# EAGLE design Puzzle Chainable RGB LED (EAGLE 6.2)
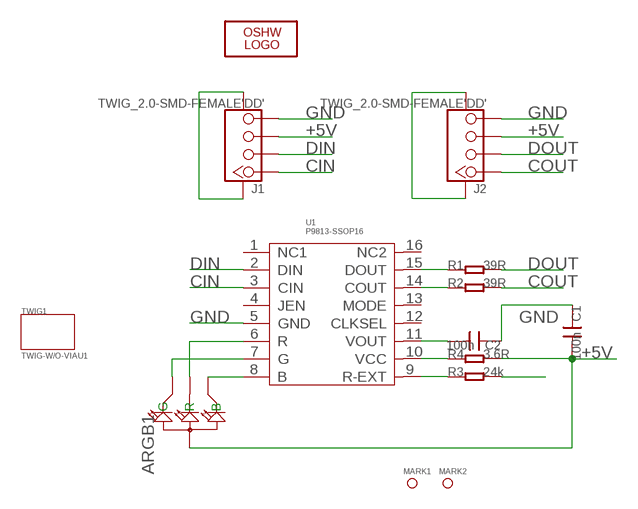
[diagram p0: schematic, sheet 1]

## Parts
ARGB1  LED-ARGB-DIP2.0  [ARGB/2.0]
C1  100n  C-0603  [0603]
C2  100n  C-0603  [0603]
J1  TWIG_2.0-SMD-FEMALE'DD'  [2.0_1X4DD]
J2  TWIG_2.0-SMD-FEMALE'DD'  [2.0_1X4DD]
LOGO1  LOGO-OSHW-FILLX0100-NT  [OSHW_FILLX100_NOTEXT]
MARK1  PAD-MARK  [MARK]
MARK2  PAD-MARK  [MARK]
R1  39R  R-0603  [0603]
R2  39R  R-0603  [0603]
R3  24k  R-0603  [0603]
R4  3.6R  R-0603  [0603]
TWIG1  TWIG-W/O-VIAU1  [U1N]
U1  P9813-SSOP16  [SSOP16]

## Nets
+5V: ARGB1.2(+) C1.2 J1.3 J2.3 R4.2
CIN: J1.1 U1.3(CIN)
COUT: J2.1 R2.2
DIN: J1.2 U1.2(DIN)
DOUT: J2.2 R1.2
GND: C1.1 C2.1 J1.4 J1.SS1 J1.SS2 J2.4 J2.SS1 J2.SS2 R3.2 U1.5(GND)
N$1: ARGB1.4(B) U1.8(B)
N$2: ARGB1.3(G) U1.7(G)
N$3: ARGB1.1(R) U1.6(R)
N$4: R1.1 U1.15(DOUT)
N$5: R2.1 U1.14(COUT)
N$6: R3.1 U1.9(R-EXT)
N$8: C2.2 U1.11(VOUT)
VCC: R4.1 U1.10(VCC)
Unconnected: U1.1(NC1) U1.4(JEN) U1.12(CLKSEL) U1.13(MODE) U1.16(NC2)

## Library data of the parts
ARGB1 = Discrete:LED-ARGB*
C1 C2 = Discrete:C*: Ceramic Capacitors
J1 J2 = Connector:TWIG_2.0-SMD-FEMALE
LOGO1 = Logo:LOGO-OSHW-FILL
MARK1 MARK2 = Discrete:PAD-MARK
R1-R4 = Discrete:R*
TWIG1 = Module:TWIG-W/O-VIA
U1 = IC:P9813-SSOP16

## Board
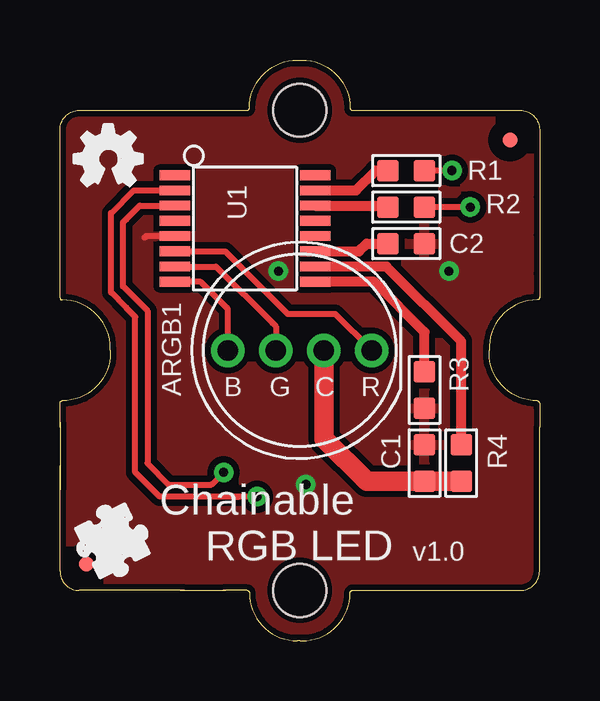
[diagram p1: board, top side]
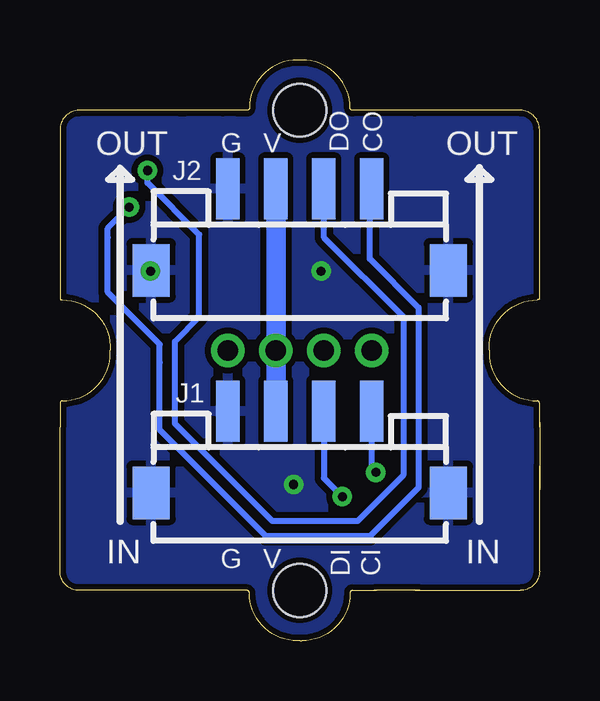
[diagram p2: board, bottom side, seen from below]

Size 20 x 24.2 mm. Coordinates in mm from the lower left corner, seen from the top.
Copper layers (1*16): Top 0.035mm / dielectric 1.5mm / Bottom 0.035mm
Design rules: minimum track width 6mil, minimum drill 12mil, track to track 6mil, track to pad 6mil, pad to pad 6mil, via to via 6mil, smd to smd 0mil, copper to edge 10mil, drill to drill 10mil, minimum pad ring 10mil, minimum via ring 6mil, stop-mask expansion 2mil, vias tented up to drill 100mil, thermal gap 10mil

### Footprints (pad centres in the part's own frame; a part is rotated, then mirrored left to right if it is on the bottom)
ARGB/2.0 = drill 0.85 pad 1.4: 1 3,0; 2 1,0; 3 -1,0; 4 -3,0
0603 = smd 0.889 x 0.889: 1 -0.762,0; 2 0.762,0
2.0_1X4DD = smd 0.965 x 2.54: 1 -3,0; 2 -1,0; 3 1,0; 4 3,0 | smd 1.55 x 2.184: SS1 -6.2,3.4; SS2 6.2,3.4
MARK = smd 0.635 x 0.635: P$1 0,0
U1N = hole 2.2: 0,-10; 0,10
SSOP16 = smd 1.27 x 0.406: 1 2.925,-2.223; 2 2.925,-1.587; 3 2.925,-0.953; 4 2.925,-0.318; 5 2.925,0.318; 6 2.925,0.953; 7 2.925,1.587; 8 2.925,2.223; 9 -2.925,2.223; 10 -2.925,1.587; 11 -2.925,0.953; 12 -2.925,0.318; 13 -2.925,-0.318; 14 -2.925,-0.953; 15 -2.925,-1.587; 16 -2.925,-2.223

### Placement (x,y rotation side)
ARGB1  10,12.1 0 top
C1  15.21,7.4 270 top
C2  14.45,16.55 180 top
J1  10,9.56 180 bottom
J2  10,18.83 180 bottom
LOGO1  0.6,18.96 0 top
MARK1  18.76,20.86 0 top
MARK2  1.11,3.21 0 top
R1  14.45,19.59 0 top
R2  14.45,18.07 0 top
R3  15.21,10.45 270 top
R4  16.73,7.4 270 top
TWIG1  10,12.1 0 top
U1  7.71,17.18 180 top
U$2  [BRICK-LOGO-MIL-0.2]  0.6,2.58 0 top

### Tracks (layer width: path | path; a pad name or v marks a point on that pad's centre or on a via)
+5V
  Top 0.813: C1.2 R4.2 12.79,6.64 11.02,8.42 11.02,12.08 ARGB1.2
  Bottom 0.813: J1.3 ARGB1.2 J2.3
CIN  (via drill 0.38 pad 0.81)
  Top 0.254: U1.3 3.33,18.13 2.76,17.56 2.63,17.43 2.63,14.89 2.63,14.77 3.65,13.75 3.65,7.4 4.54,6.51 6.32,6.51 v6.82,7.02
  Bottom 0.254: J1.1 7,7.2 v6.82,7.02
COUT  (via drill 0.38 pad 0.81)
  Top 0.254: v17.11,18.07 R2.2
  Bottom 0.254: 7.08,18.88 7.08,15.91 5.05,13.88 5.05,6.39 5.17,6.26 7.08,4.35 11.4,4.35 15.84,8.8 15.84,11.59 15.84,12.35 17.75,14.26 18,14.51 18,16.8 18,17.18 v17.11,18.07
  Bottom 0.305: 7.08,18.88 J2.1
DIN  (via drill 0.38 pad 0.81)
  Top 0.254: U1.2 3.08,18.77 2.13,17.81 2.13,14.51 2.76,13.88 3.02,13.62 3.14,13.5 3.14,7.02 4.16,6 7.33,6 | 7.33,6 7.46,6 | v8.22,6 7.33,6
  Bottom 0.254: J1.2 9,6.78 v8.22,6
DOUT  (via drill 0.38 pad 0.81)
  Top 0.254: v16.35,19.59 R1.2
  Bottom 0.254: 8.98,18.94 8.98,16.8 5.68,13.5 5.68,6.89 7.59,4.99 11.14,4.99 15.21,9.05 15.21,11.97 15.21,12.48 14.19,13.5 14.19,16.93 16.35,19.09 v16.35,19.59
  Bottom 0.305: 8.98,18.94 J2.2
GND  (via drill 0.38 pad 0.81)
  Top 0.254: U1.5 3.59,16.86 3.52,16.8
  other vias: 10.25,6.51 9.11,15.4 16.22,15.4
  pour Bottom (isolate 0.254): -0.16,24.16 20.16,24.16 20.16,0.04 -0.16,0.04
  pour Top (isolate 0.254): -0.16,0.04 20.16,0.04 20.16,24.16 -0.16,24.16
N$1
  Top 0.254: U1.8 5.87,14.96 6.95,13.88 7,13.83 ARGB1.4
N$2
  Top 0.254: U1.7 6.51,15.59 8.86,13.24 9,13.1 ARGB1.3
N$3
  Top 0.254: U1.6 6.89,16.23 9.37,13.75 9.49,13.62 11.48,13.62 ARGB1.1
N$4
  Top 0.406: U1.15 12.35,18.77 13.18,19.59 R1.1
N$5
  Top 0.406: U1.14 13.62,18.13 R2.1
N$6
  Top 0.406: U1.9 13.11,14.96 15.21,12.86 R3.1
N$8
  Top 0.406: C2.2 12.79,16.55 12.48,16.23 U1.11
VCC
  Top 0.406: R4.1 16.73,11.46 | 16.73,11.46 16.73,11.59 | U1.10 13.62,15.59 16.73,12.48 16.73,11.46

### Text on the board
tPlace: Chainable | RGB LED | v1.0
bPlace: OUT | CO | DO | V | G | OUT | IN | IN | CI | DI | V | G